# Altium schematic sheet sd.SchDoc
size B
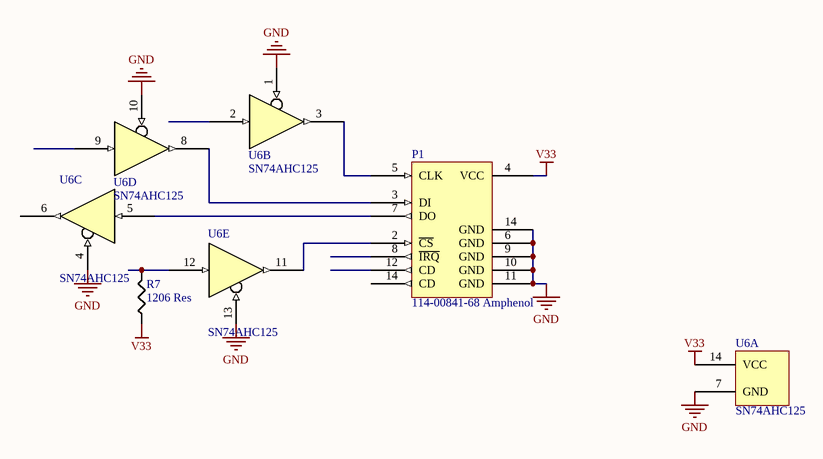
[diagram p0: sd.SchDoc]

## Parts
P1  114-00841-68 Amphenol  [Final Board uSD]
R7  1206 Res  [RESC3115X06M]
U6  SN74AHC125  [DIP14]  (parts A,B,C,D,E of 5)

## Nets
GND: P1.6(GND) P1.9(GND) P1.10(GND) P1.11(GND) P1.14(CD) U6.1(1~{OE}) U6.4(2~{OE}) U6.7(GND) U6.10(3~{OE}) U6.13(4~{OE})
V33: P1.4(VCC) R7.1 U6.14(VCC)
NetP1_2: P1.2(~{CS}) U6.11(4Y)
NetP1_3: P1.3(DI) U6.8(3Y)
NetP1_5: P1.5(CLK) U6.3(1Y)
NetP1_7: P1.7(DO) U6.5(2A)
NetR7_2: R7.2 U6.12(4A)

Not connected (* = marked no-connect by the designer): P1 1(NC) 8(~{IRQ}) 12(CD); U6 2(1A) 6(2Y) 9(3A)

## Library data of the parts
P1 = uSD - 101-00660: MicroSD Card Slot
R7 = 1206 Resistor
U6 = SN74AHC125: Quad Input Buffer